# Altium schematic sheet WS2812B.SchDoc
size A4; DocumentNumber: 20; SheetNumber: ALT0056; SheetTotal: 21
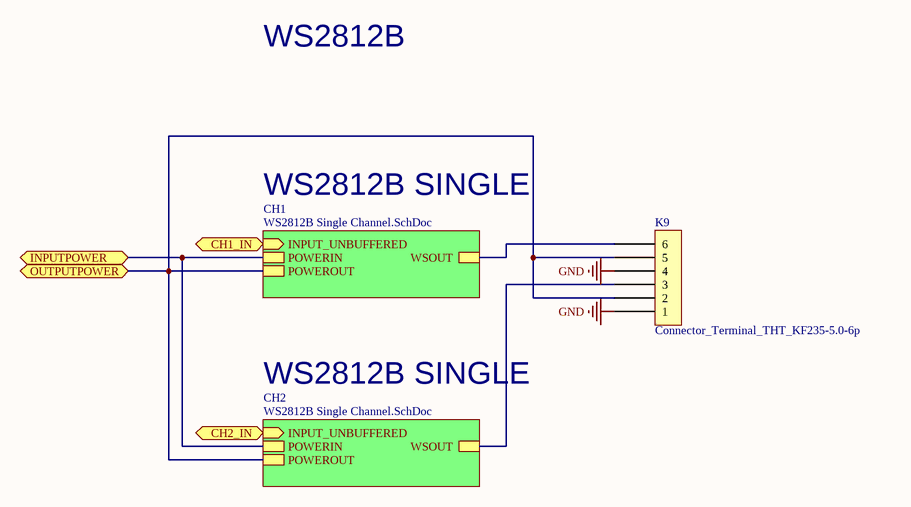
[diagram p0: WS2812B.SchDoc]

## Parts
K9  Connector_Terminal_THT_KF235-5.0-6p  [KF235-5.0-6p]

## Sub-sheets
CH1 = WS2812B Single Channel.SchDoc: INPUT_UNBUFFERED (in), POWERIN, POWEROUT, WSOUT
CH2 = WS2812B Single Channel.SchDoc: INPUT_UNBUFFERED (in), POWERIN, POWEROUT, WSOUT

## Ports
CH1_IN (in), CH2_IN (in), INPUTPOWER, OUTPUTPOWER

## Nets
GND: K9.1 K9.4
CH1_IN: port CH1_IN, sheet CH1/INPUT_UNBUFFERED
CH2_IN: port CH2_IN, sheet CH2/INPUT_UNBUFFERED
INPUTPOWER: port INPUTPOWER, sheet CH1/POWERIN, sheet CH2/POWERIN
OUTPUTPOWER: K9.2 K9.5 ; port OUTPUTPOWER, sheet CH1/POWEROUT, sheet CH2/POWEROUT
NetK9_3: K9.3 ; sheet CH2/WSOUT
NetK9_6: K9.6 ; sheet CH1/WSOUT

## Notes on the sheet
- WS2812B
- WS2812B SINGLE
- Title
- Size:
- Date:
- A4
- Number:
- Time:
- Revision:
- Sheet
- of
- File: